# EAGLE design JAD_1_0 (EAGLE 8.3.2)
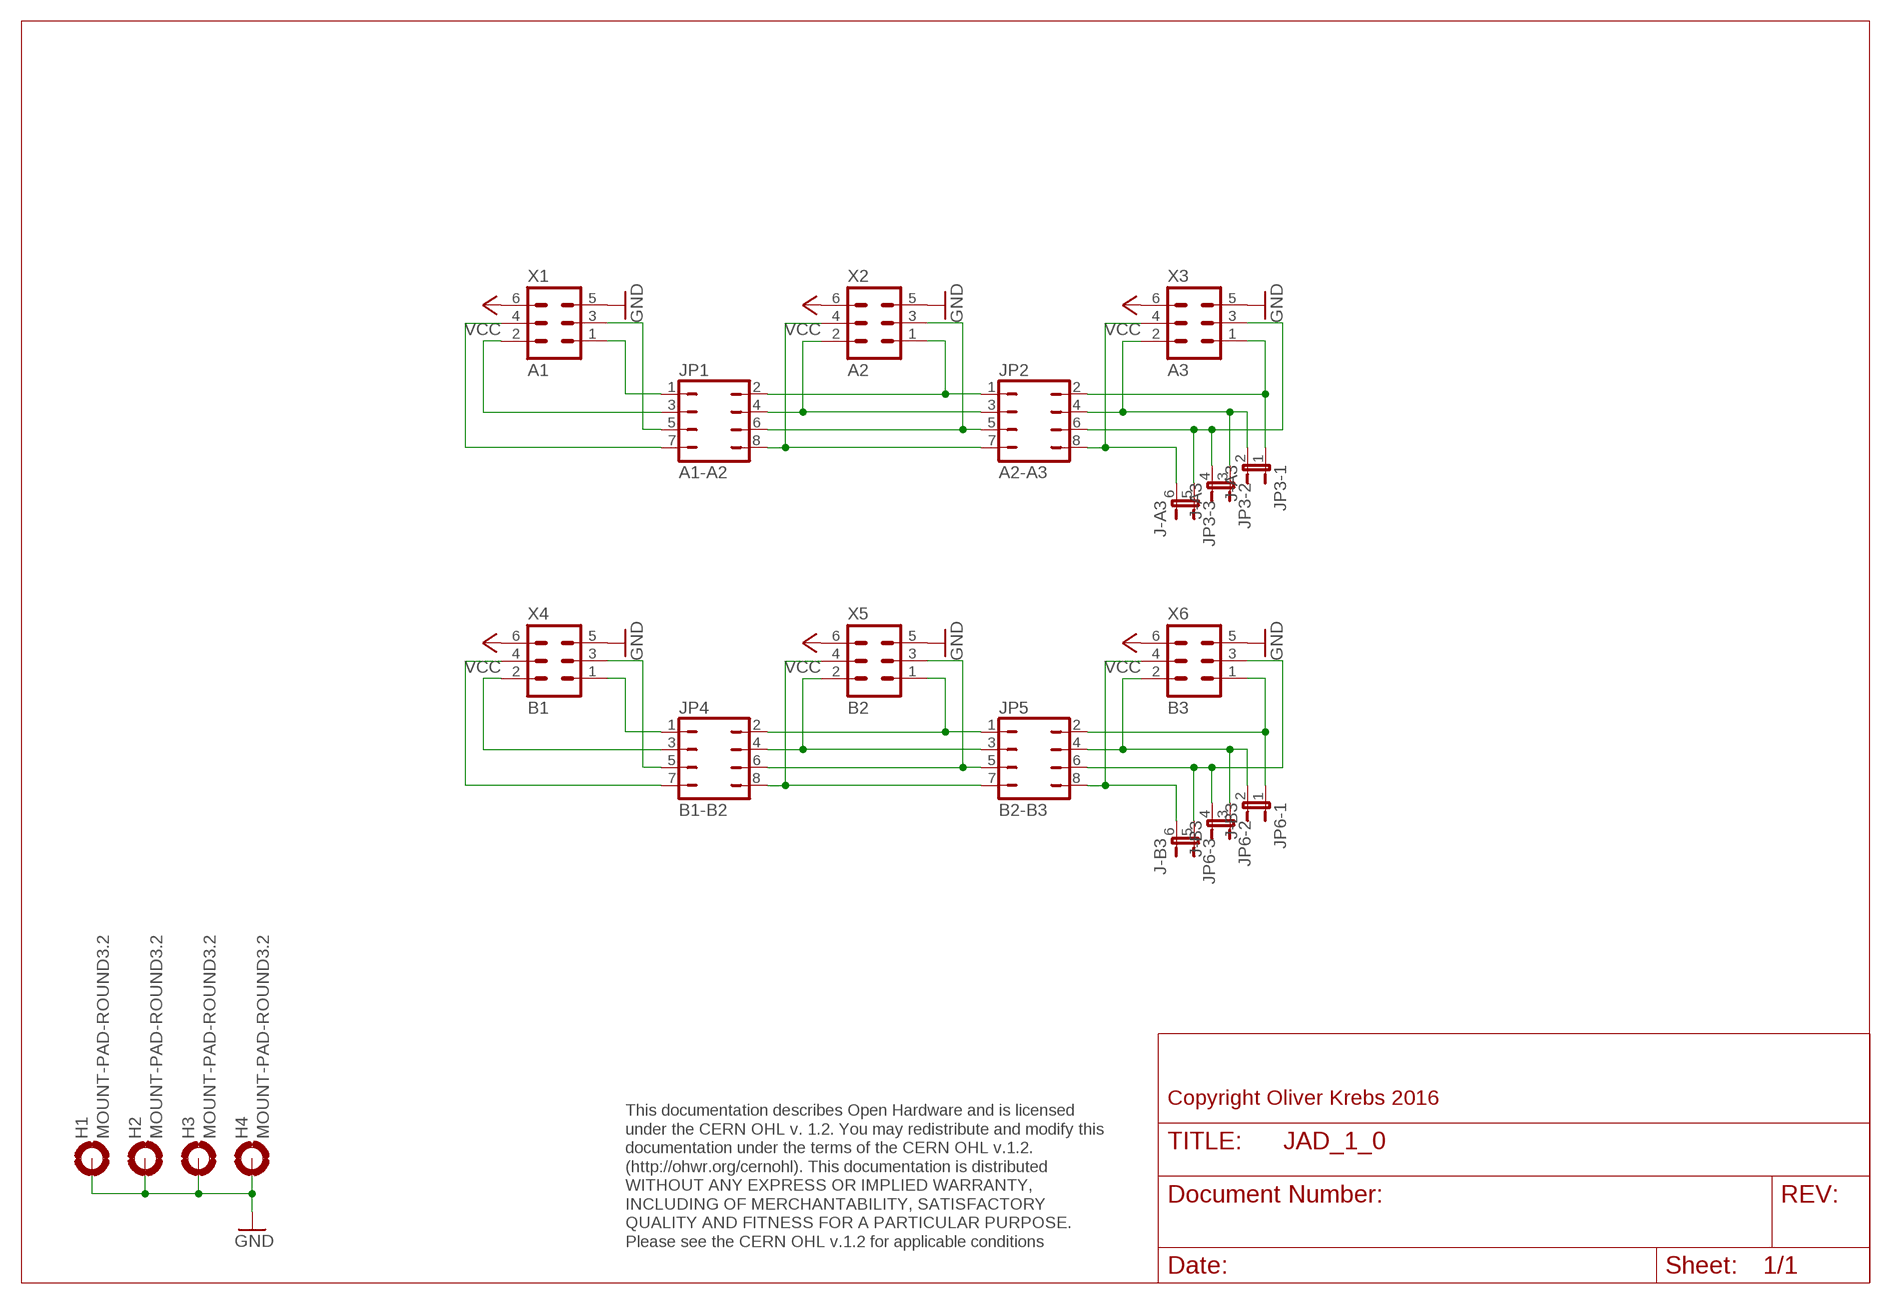
[diagram p0: schematic, sheet 1]

## Parts
H1  MOUNT-PAD-ROUND3.2  [3,2-PAD]
H2  MOUNT-PAD-ROUND3.2  [3,2-PAD]
H3  MOUNT-PAD-ROUND3.2  [3,2-PAD]
H4  MOUNT-PAD-ROUND3.2  [3,2-PAD]
JP1  A1-A2  JP4Q  [JP4Q]
JP2  A2-A3  JP4Q  [JP4Q]
JP3  J-A3  JP3QE  [JP3Q]
JP4  B1-B2  JP4Q  [JP4Q]
JP5  B2-B3  JP4Q  [JP4Q]
JP6  J-B3  JP3QE  [JP3Q]
X1  A1  ML6  [ML-6]
X2  A2  ML6  [ML-6]
X3  A3  ML6  [ML-6]
X4  B1  ML6  [ML-6]
X5  B2  ML6  [ML-6]
X6  B3  ML6  [ML-6]

## Nets
GND: H1.B3,2(MOUNT) H2.B3,2(MOUNT) H3.B3,2(MOUNT) H4.B3,2(MOUNT) X1.5 X2.5 X3.5 X4.5 X5.5 X6.5
N$1: JP1.1 X1.1
N$2: JP1.3 X1.2
N$3: JP1.5 X1.3
N$4: JP1.7 X1.4
N$5: JP1.2 JP2.1 X2.1
N$6: JP1.4 JP2.3 X2.2
N$7: JP1.6 JP2.5 X2.3
N$8: JP1.8 JP2.7 X2.4
N$9: JP2.2 JP3.1 X3.1
N$10: JP2.4 JP3.2 JP3.3 X3.2
N$11: JP2.6 JP3.4 JP3.5 X3.3
N$12: JP2.8 JP3.6 X3.4
N$13: JP4.1 X4.1
N$14: JP4.3 X4.2
N$15: JP4.5 X4.3
N$16: JP4.7 X4.4
N$17: JP4.2 JP5.1 X5.1
N$18: JP4.4 JP5.3 X5.2
N$19: JP4.6 JP5.5 X5.3
N$20: JP4.8 JP5.7 X5.4
N$21: JP5.2 JP6.1 X6.1
N$22: JP5.4 JP6.2 JP6.3 X6.2
N$23: JP5.6 JP6.4 JP6.5 X6.3
N$24: JP5.8 JP6.6 X6.4
VCC: X1.6 X2.6 X3.6 X4.6 X5.6 X6.6

## Notes on the sheet
- Copyright Oliver Krebs 2016
- This documentation describes Open Hardware and is licensed 
  under the CERN OHL v. 1.2. You may redistribute and modify this 
  documentation under the terms of the CERN OHL v.1.2. 
  (http://ohwr.org/cernohl). This documentation is distributed
  WITHOUT ANY EXPRESS OR IMPLIED WARRANTY, 
  INCLUDING OF MERCHANTABILITY, SATISFACTORY 
  QUALITY AND FITNESS FOR A PARTICULAR PURPOSE. 
  Please see the CERN OHL v.1.2 for applicable conditions

## Library data of the parts
H1-H4 = holes:MOUNT-PAD-ROUND: MOUNTING PAD, round
JP1 JP2 JP4 JP5 = 01-my-con:JP4Q
JP3 JP6 = 01-my-con:JP3QE
X1-X6 = 01-my-con:ML6

## Board
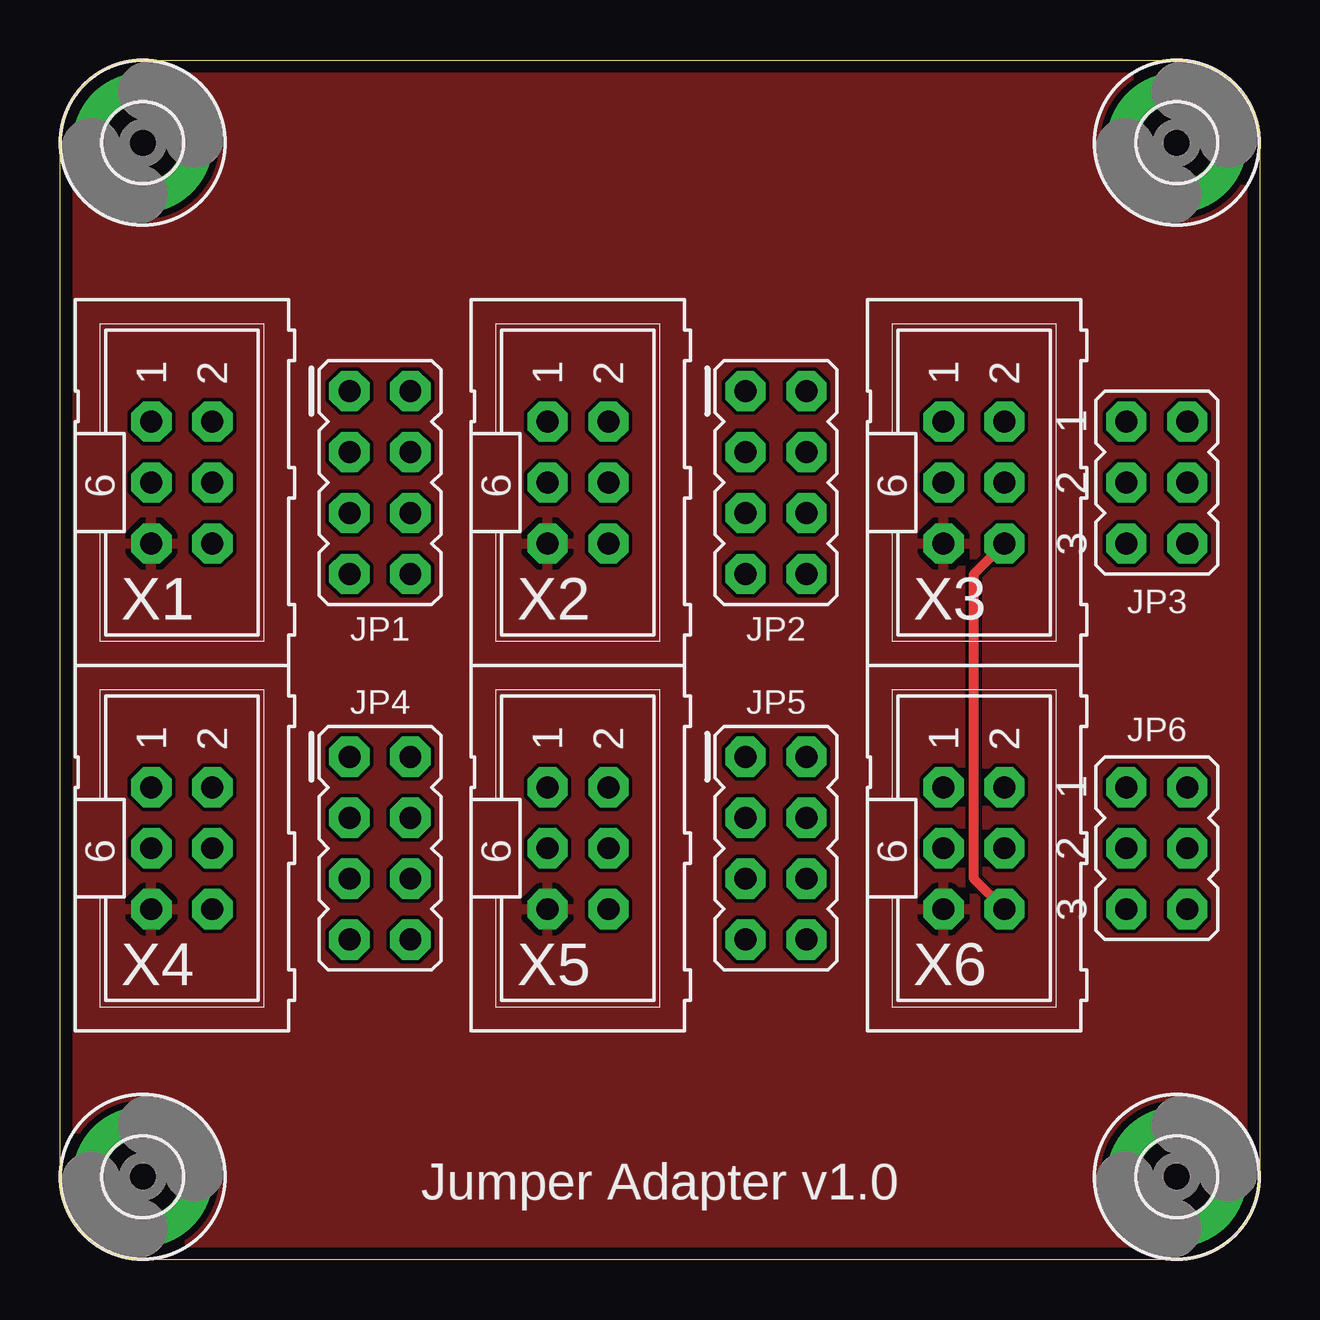
[diagram p1: board, top side]
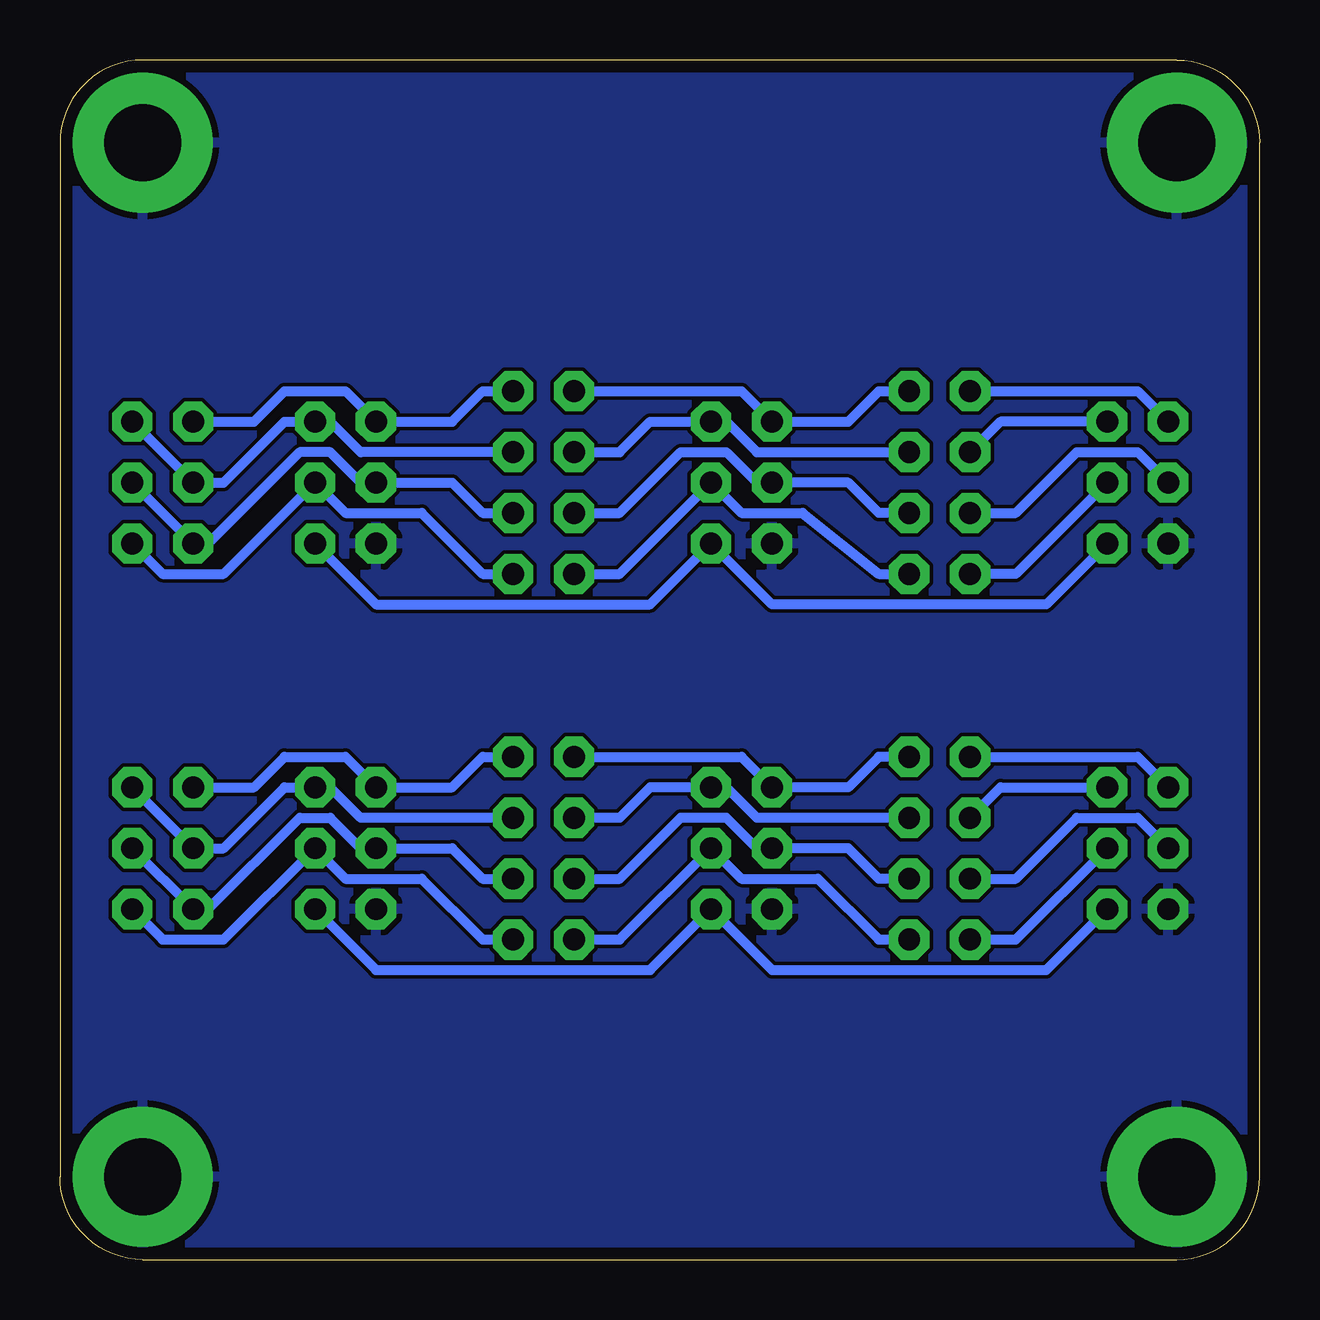
[diagram p2: board, bottom side, seen from below]

Size 50 x 50 mm. Coordinates in mm from the lower left corner, seen from the top.
Outline: 0,3.45 0,46.55 arc-90 3.45,50 46.55,50 arc-90 50,46.55 50,3.45 arc-90 46.55,0 3.45,0 arc-90 0,3.45
Copper layers (1*16): Top 0.035mm / dielectric 1.6mm / Bottom 0.035mm
Design rules "Elecrow_2-layer_PCB_eagle_rule": minimum track width 6mil, minimum drill 12mil, track to track 6mil, track to pad 6mil, pad to pad 6mil, via to via 8mil, smd to smd 0mil, copper to edge 20mil, drill to drill 10mil, minimum pad ring 6mil, minimum via ring 6mil, stop-mask expansion 0mil, vias tented up to drill 100mil, thermal gap 10mil

### Footprints (pad centres in the part's own frame; a part is rotated, then mirrored left to right if it is on the bottom)
3,2-PAD = drill 3.2 pad 5.842: B3,2 0,0
JP4Q = drill 0.914 pad 1.676 octagon: 1 -3.81,-1.27; 2 -3.81,1.27; 3 -1.27,-1.27; 4 -1.27,1.27; 5 1.27,-1.27; 6 1.27,1.27; 7 3.81,-1.27; 8 3.81,1.27
JP3Q = drill 0.914 pad 1.676 octagon: 1 -2.54,-1.27; 2 -2.54,1.27; 3 0,-1.27; 4 0,1.27; 5 2.54,-1.27; 6 2.54,1.27
ML-6 = drill 0.914 pad 1.676 octagon: 1 -2.54,-1.27; 2 -2.54,1.27; 3 0,-1.27; 4 0,1.27; 5 2.54,-1.27; 6 2.54,1.27

### Placement (x,y rotation side)
H1  3.45,3.45 0 top
H2  3.45,46.55 0 top
H3  46.55,46.55 0 top
H4  46.55,3.45 0 top
JP1  13.34,32.38 270 top
JP2  29.84,32.38 270 top
JP3  45.72,32.38 270 top
JP4  13.34,17.14 270 top
JP5  29.84,17.14 270 top
JP6  45.72,17.14 270 top
X1  5.08,32.38 270 top
X2  21.59,32.38 270 top
X3  38.1,32.38 270 top
X4  5.08,17.14 270 top
X5  21.59,17.14 270 top
X6  38.1,17.14 270 top

### Tracks (layer width: path | path; a pad name or v marks a point on that pad's centre or on a via)
GND
  pour Top: 0,50.16 50.16,50.16 50.16,0 0,0
  pour Bottom: 0,50.16 50.16,50.16 50.16,0 0,0
N$1
  Bottom 0.406: JP1.1 5.08,36.2 X1.1
N$2
  Bottom 0.406: X1.2 10.79,34.92 JP1.3
N$3
  Bottom 0.406: JP1.5 10.16,31.11 7.62,33.66 5.08,33.66 X1.3
N$4
  Bottom 0.406: X1.4 10.16,28.57 JP1.7
N$5
  Bottom 0.406: JP2.1 21.59,36.2 X2.1 17.14,34.92 15.88,36.2 JP1.2
N$6
  Bottom 0.406: JP2.3 26.67,33.66 25.4,34.92 X2.2 22.23,34.92 20.95,33.66 JP1.4
N$7
  Bottom 0.406: JP2.5 26.67,31.11 24.13,33.66 22.23,33.66 20.95,32.38 X2.3 17.14,32.38 15.88,31.11 JP1.6
N$8
  Bottom 0.406: JP2.7 26.67,28.57 X2.4 21.59,31.11 19.05,31.11 15.88,28.57 JP1.8
N$9
  Bottom 0.406: JP2.2 32.38,36.2 33.66,34.92 X3.1 38.1,36.2 40.64,36.2 41.91,34.92 JP3.1
N$10
  Bottom 0.406: JP3.2 JP3.3 43.18,32.38 40.64,34.92 X3.2 38.73,34.92 37.47,33.66 JP2.4
N$11
  Bottom 0.406: JP3.4 JP3.5 43.81,29.84 40.01,33.66 38.73,33.66 37.47,32.38 X3.3 33.66,32.38 32.38,31.11 JP2.6
N$12
  Bottom 0.406: JP2.8 32.38,28.57 34.92,31.11 38.1,31.11 X3.4 43.18,28.57 45.72,28.57 JP3.6
N$13
  Bottom 0.406: JP4.1 5.08,20.95 X4.1
N$14
  Bottom 0.406: JP4.3 10.79,19.68 X4.2
N$15
  Bottom 0.406: JP4.5 10.16,15.88 7.62,18.41 5.08,18.41 X4.3
N$16
  Bottom 0.406: JP4.7 10.16,13.34 X4.4
N$17
  Bottom 0.406: JP4.2 15.88,20.95 17.14,19.68 X5.1 21.59,20.95 JP5.1
N$18
  Bottom 0.406: JP5.3 26.67,18.41 25.4,19.68 X5.2 22.23,19.68 20.95,18.41 JP4.4
N$19
  Bottom 0.406: JP5.5 26.67,15.88 24.13,18.41 22.23,18.41 20.95,17.14 X5.3 17.14,17.14 15.88,15.88 JP4.6
N$20
  Bottom 0.406: JP5.7 26.67,13.34 X5.4 21.59,15.88 18.41,15.88 15.88,13.34 JP4.8
N$21
  Bottom 0.406: JP5.2 32.38,20.95 33.66,19.68 X6.1 38.1,20.95 40.64,20.95 41.91,19.68 JP6.1
N$22
  Bottom 0.406: JP6.2 JP6.3 43.18,17.14 40.64,19.68 X6.2 38.73,19.68 37.47,18.41 JP5.4
N$23
  Bottom 0.406: JP6.4 JP6.5 43.81,14.61 40.01,18.41 38.73,18.41 37.47,17.14 X6.3 33.66,17.14 32.38,15.88 JP5.6
N$24
  Bottom 0.406: JP5.8 32.38,13.34 34.92,15.88 38.1,15.88 X6.4 43.18,13.34 45.72,13.34 JP6.6
VCC
  Top 0.406: X6.6 38.1,15.88 38.1,28.57 X3.6
  Bottom 0.406: X1.6 8.89,27.3 20.32,27.3 X2.6 25.4,27.3 36.83,27.3 X3.6 | X4.6 8.89,12.06 20.32,12.06 X5.6 25.4,12.06 36.83,12.06 X6.6

### Text on the board
tNames: Jumper Adapter v1.0
200bmp: E:/Bilder/Elektronik/Modulion/Mexdulon/mexdulon_50x50_pcb.bmp